# Altium schematic sheet RPi_Carrier.SchDoc
size A; SPICEModelCacheFYOWLMMU: <root> / <DocumentId>FYOWLMMU</DocumentId> / </root>; SheetNumber: 1; SheetTotal: 4; CompanyName: Gamber-Johnson LLC; Organization: CD Cell
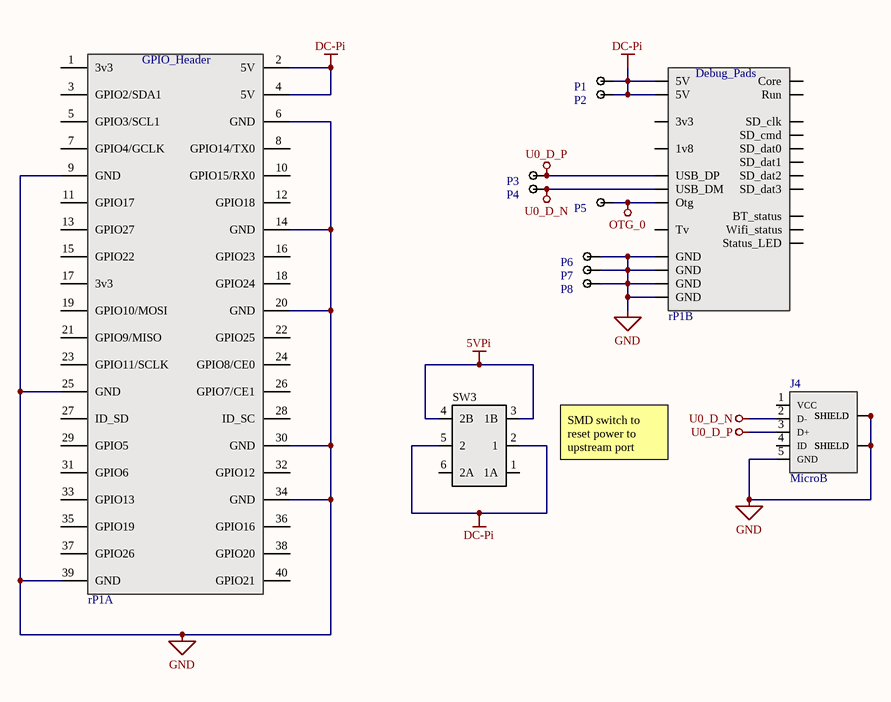
[diagram p0: RPi_Carrier.SchDoc]

## Parts
J4  MicroB  [10118194-0001LF]
P1  MillMax Pogo  [0914-1-15-20-77-14-11-0]  (value not drawn)
P2  MillMax Pogo  [0914-1-15-20-77-14-11-0]  (value not drawn)
P3  MillMax Pogo  [0914-1-15-20-77-14-11-0]  (value not drawn)
P4  MillMax Pogo  [0914-1-15-20-77-14-11-0]  (value not drawn)
P5  MillMax Pogo  [0914-1-15-20-77-14-11-0]  (value not drawn)
P6  MillMax Pogo  [0914-1-15-20-77-14-11-0]  (value not drawn)
P7  MillMax Pogo  [0914-1-15-20-77-14-11-0]  (value not drawn)
P8  MillMax Pogo  [0914-1-15-20-77-14-11-0]  (value not drawn)
rP1  rPi Zero Carrier  [rPiZero]  (value not drawn)  (parts A,B of 2)
SW3  (no value)  [SMD-DPDT-SW]

## Nets
5VPi: SW3.3(1B) SW3.4(2B)
DC-Pi: P1.1 P2.1 rP1.2(5V) rP1.4(5V) rP1.5V1(5V) rP1.5V2(5V) SW3.2(1) SW3.5(2)
GND: J4.5(GND) J4.SH1(SHIELD) J4.SH2(SHIELD) J4.SH3(SHIELD) J4.SH4(SHIELD) J4.SH5(SHIELD) J4.SH6(SHIELD) P6.1 P7.1 P8.1 rP1.6(GND) rP1.9(GND) rP1.14(GND) rP1.20(GND) rP1.25(GND) rP1.30(GND) rP1.34(GND) rP1.39(GND) rP1.G1(GND) rP1.G2(GND) rP1.G3(GND) rP1.G4(GND)
OTG_0: P5.1 rP1.OTG(Otg)
U0_D_N: J4.2(D-) P4.1 rP1.USB_DM
U0_D_P: J4.3(D+) P3.1 rP1.USB_DP

Not connected (* = marked no-connect by the designer): J4 1(VCC) 4(ID); rP1 1(3v3) 1V8(1v8) 3(GPIO2/SDA1) 3V3(3v3) 5(GPIO3/SCL1) 7(GPIO4/GCLK) 8(GPIO14/TX0) 10(GPIO15/RX0) 11(GPIO17) 12(GPIO18) 13(GPIO27) 15(GPIO22) 16(GPIO23) 17(3v3) 18(GPIO24) 19(GPIO10/MOSI) 21(GPIO9/MISO) 22(GPIO25) 23(GPIO11/SCLK) 24(GPIO8/CE0) 26(GPIO7/CE1) 27(ID_SD) 28(ID_SC) 29(GPIO5) 31(GPIO6) 32(GPIO12) 33(GPIO13) 35(GPIO19) 36(GPIO16) 37(GPIO26) 38(GPIO20) 40(GPIO21) BT_ON(BT_status) CORE(Core) RUN(Run) SD_CLK(SD_clk) SD_CMD(SD_cmd) SD_DAT0(SD_dat0) SD_DAT1(SD_dat1) SD_DAT2(SD_dat2) SD_DAT3(SD_dat3) STATUS(Status_LED) TV(Tv) WL_ON(Wifi_status); SW3 1(1A) 6(2A)

## Notes on the sheet
- SMD switch to reset power to upstream port
- REV
- REVISIONS
- DATE
- DESCRIPTION
- BY
- UNLESS OTHERWISE SPECIFIED, DRAWING DEFINITIONS AND TOLERANCES SHALL BE FOUND UNDER SUPPLIER STANDARDS SS-001. THIS PART AND ALL COMPONENTS OF IT MUST BE RoHS & REACH COMPLIANT. A CERTIFICATE OF COMPLIANCE MUST BE PROVIDED UPON REQUEST.
- ALL INFORMATION ON THIS DOCUMENT IS THE SOLE PROPERTY OF GAMBER-JOHNSON AND SHALL NOT BE COPIED, REPRODUCED, USED OR DISCLOSED IN WHOLE OR IN PART WITHOUT THE WRITTEN CONSENT OF GAMBER-JOHNSON
- TOLERANCES
  .00 ± .060
  .000 ± .020
  .0000 ± .005
  ANGELS ± 1°
- DRAWN BY:
- PROJECT NUMBER:
- SHEET TITLE:
- SHEET
- OF
- DATE:
- LOCATION:
- ASSEMBLY NUMBER
- SIZE
- GAMBER-JOHNSON LLC
  5001 Joerns Dr
  STEVENS POINT, WI 54481
  +1 (715) 344-5209
- A
- (in symbol RP-Zero, part A) GPIO_Header
- (in symbol RP-Zero, part B) Debug_Pads

## Library data of the parts
J4 = 10118194-0001LF: Micro USB, Input Output Connectors, B TYPE RECEPTACLE with flange; MF: Amphenol ICC; SnapEDA_Link: https://www.snapeda.com/parts/10118194-0001LF/Amphenol+FCI/view-part/?ref=snap; Package: None; Value: *; MP: 10118194-0001LF; Check_prices: https://www.snapeda.com/parts/10118194-0001LF/Amphenol+FCI/view-part/?ref=eda; LCSC PN: C132563
P1-P8 = GenericPogo: MillMax Pogo Pins/Probes
rP1 = RP-Zero: Raspberry Pi Zero/W/2W / Header, debug-pads, & mounting
SW3 = MS-22D17-G2: Brick nogging DPDT Black SMD Slide Switch; LCSC PN: C2904912